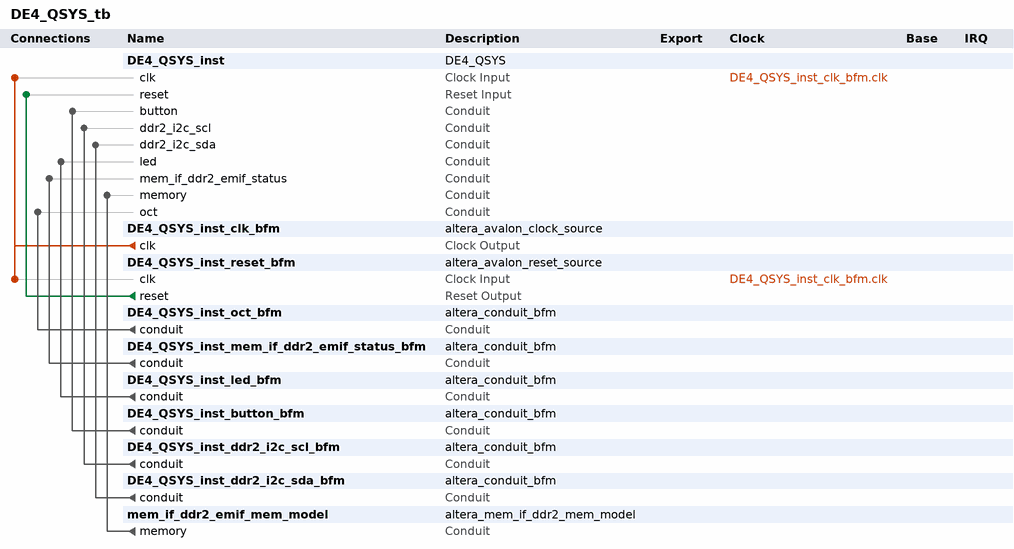
[diagram p0: system contents]
# Platform Designer (Qsys) system DE4_QSYS_tb, Stratix IV EP4SGX530KH40C2
# Parameters at their usual value, and those the tool derives, are not listed.
package require -exact qsys 13.0
create_system DE4_QSYS_tb
set_project_property DEVICE_FAMILY {Stratix IV}
set_project_property DEVICE EP4SGX530KH40C2

add_instance DE4_QSYS_inst DE4_QSYS 1.0

add_instance DE4_QSYS_inst_clk_bfm altera_avalon_clock_source 13.0

add_instance DE4_QSYS_inst_reset_bfm altera_avalon_reset_source 13.0
set_instance_parameter_value DE4_QSYS_inst_reset_bfm ASSERT_HIGH_RESET 0
set_instance_parameter_value DE4_QSYS_inst_reset_bfm INITIAL_RESET_CYCLES 50

add_instance DE4_QSYS_inst_oct_bfm altera_conduit_bfm 13.0
set_instance_parameter_value DE4_QSYS_inst_oct_bfm CLOCKED_SIGNAL false
set_instance_parameter_value DE4_QSYS_inst_oct_bfm ENABLE_RESET false
set_instance_parameter_value DE4_QSYS_inst_oct_bfm SIGNAL_ROLES rdn,rup
set_instance_parameter_value DE4_QSYS_inst_oct_bfm SIGNAL_WIDTHS 1,1
set_instance_parameter_value DE4_QSYS_inst_oct_bfm SIGNAL_DIRECTIONS output,output

add_instance DE4_QSYS_inst_mem_if_ddr2_emif_status_bfm altera_conduit_bfm 13.0
set_instance_parameter_value DE4_QSYS_inst_mem_if_ddr2_emif_status_bfm CLOCKED_SIGNAL false
set_instance_parameter_value DE4_QSYS_inst_mem_if_ddr2_emif_status_bfm ENABLE_RESET false
set_instance_parameter_value DE4_QSYS_inst_mem_if_ddr2_emif_status_bfm SIGNAL_ROLES local_init_done,local_cal_success,local_cal_fail
set_instance_parameter_value DE4_QSYS_inst_mem_if_ddr2_emif_status_bfm SIGNAL_WIDTHS 1,1,1
set_instance_parameter_value DE4_QSYS_inst_mem_if_ddr2_emif_status_bfm SIGNAL_DIRECTIONS input,input,input

add_instance DE4_QSYS_inst_led_bfm altera_conduit_bfm 13.0
set_instance_parameter_value DE4_QSYS_inst_led_bfm CLOCKED_SIGNAL false
set_instance_parameter_value DE4_QSYS_inst_led_bfm ENABLE_RESET false
set_instance_parameter_value DE4_QSYS_inst_led_bfm SIGNAL_WIDTHS 8
set_instance_parameter_value DE4_QSYS_inst_led_bfm SIGNAL_DIRECTIONS input

add_instance DE4_QSYS_inst_button_bfm altera_conduit_bfm 13.0
set_instance_parameter_value DE4_QSYS_inst_button_bfm CLOCKED_SIGNAL false
set_instance_parameter_value DE4_QSYS_inst_button_bfm ENABLE_RESET false
set_instance_parameter_value DE4_QSYS_inst_button_bfm SIGNAL_WIDTHS 4
set_instance_parameter_value DE4_QSYS_inst_button_bfm SIGNAL_DIRECTIONS output

add_instance DE4_QSYS_inst_ddr2_i2c_scl_bfm altera_conduit_bfm 13.0
set_instance_parameter_value DE4_QSYS_inst_ddr2_i2c_scl_bfm CLOCKED_SIGNAL false
set_instance_parameter_value DE4_QSYS_inst_ddr2_i2c_scl_bfm ENABLE_RESET false
set_instance_parameter_value DE4_QSYS_inst_ddr2_i2c_scl_bfm SIGNAL_WIDTHS 1
set_instance_parameter_value DE4_QSYS_inst_ddr2_i2c_scl_bfm SIGNAL_DIRECTIONS input

add_instance DE4_QSYS_inst_ddr2_i2c_sda_bfm altera_conduit_bfm 13.0
set_instance_parameter_value DE4_QSYS_inst_ddr2_i2c_sda_bfm CLOCKED_SIGNAL false
set_instance_parameter_value DE4_QSYS_inst_ddr2_i2c_sda_bfm ENABLE_RESET false
set_instance_parameter_value DE4_QSYS_inst_ddr2_i2c_sda_bfm SIGNAL_WIDTHS 1
set_instance_parameter_value DE4_QSYS_inst_ddr2_i2c_sda_bfm SIGNAL_DIRECTIONS bidir

add_instance mem_if_ddr2_emif_mem_model altera_mem_if_ddr2_mem_model 13.0
set_instance_parameter_value mem_if_ddr2_emif_mem_model MEM_VENDOR Micron
set_instance_parameter_value mem_if_ddr2_emif_mem_model MEM_FORMAT UNBUFFERED
set_instance_parameter_value mem_if_ddr2_emif_mem_model DISCRETE_FLY_BY true
set_instance_parameter_value mem_if_ddr2_emif_mem_model DEVICE_DEPTH 1
set_instance_parameter_value mem_if_ddr2_emif_mem_model MEM_MIRROR_ADDRESSING 0
set_instance_parameter_value mem_if_ddr2_emif_mem_model MEM_CLK_FREQ_MAX 400.0
set_instance_parameter_value mem_if_ddr2_emif_mem_model MEM_ROW_ADDR_WIDTH 14
set_instance_parameter_value mem_if_ddr2_emif_mem_model MEM_COL_ADDR_WIDTH 10
set_instance_parameter_value mem_if_ddr2_emif_mem_model MEM_DQ_WIDTH 64
set_instance_parameter_value mem_if_ddr2_emif_mem_model MEM_DQ_PER_DQS 8
set_instance_parameter_value mem_if_ddr2_emif_mem_model MEM_BANKADDR_WIDTH 3
set_instance_parameter_value mem_if_ddr2_emif_mem_model MEM_IF_DM_PINS_EN true
set_instance_parameter_value mem_if_ddr2_emif_mem_model MEM_IF_DQSN_EN true
set_instance_parameter_value mem_if_ddr2_emif_mem_model MEM_NUMBER_OF_DIMMS 1
set_instance_parameter_value mem_if_ddr2_emif_mem_model MEM_NUMBER_OF_RANKS_PER_DIMM 1
set_instance_parameter_value mem_if_ddr2_emif_mem_model MEM_NUMBER_OF_RANKS_PER_DEVICE 1
set_instance_parameter_value mem_if_ddr2_emif_mem_model MEM_RANK_MULTIPLICATION_FACTOR 1
set_instance_parameter_value mem_if_ddr2_emif_mem_model MEM_CK_WIDTH 2
set_instance_parameter_value mem_if_ddr2_emif_mem_model MEM_CS_WIDTH 1
set_instance_parameter_value mem_if_ddr2_emif_mem_model MEM_CLK_EN_WIDTH 1
set_instance_parameter_value mem_if_ddr2_emif_mem_model ALTMEMPHY_COMPATIBLE_MODE false
set_instance_parameter_value mem_if_ddr2_emif_mem_model NEXTGEN true
set_instance_parameter_value mem_if_ddr2_emif_mem_model MEM_IF_BOARD_BASE_DELAY 10
set_instance_parameter_value mem_if_ddr2_emif_mem_model MEM_IF_SIM_VALID_WINDOW 0
set_instance_parameter_value mem_if_ddr2_emif_mem_model MEM_GUARANTEED_WRITE_INIT false
set_instance_parameter_value mem_if_ddr2_emif_mem_model MEM_VERBOSE true
set_instance_parameter_value mem_if_ddr2_emif_mem_model PINGPONGPHY_EN false
set_instance_parameter_value mem_if_ddr2_emif_mem_model REFRESH_BURST_VALIDATION false
set_instance_parameter_value mem_if_ddr2_emif_mem_model MEM_BL 8
set_instance_parameter_value mem_if_ddr2_emif_mem_model MEM_BT Sequential
set_instance_parameter_value mem_if_ddr2_emif_mem_model MEM_ASR Manual
set_instance_parameter_value mem_if_ddr2_emif_mem_model MEM_SRT {2x refresh rate}
set_instance_parameter_value mem_if_ddr2_emif_mem_model MEM_PD {Fast exit}
set_instance_parameter_value mem_if_ddr2_emif_mem_model MEM_DRV_STR Full
set_instance_parameter_value mem_if_ddr2_emif_mem_model MEM_DLL_EN true
set_instance_parameter_value mem_if_ddr2_emif_mem_model MEM_RTT_NOM 50
set_instance_parameter_value mem_if_ddr2_emif_mem_model MEM_ATCL 0
set_instance_parameter_value mem_if_ddr2_emif_mem_model MEM_TCL 6
set_instance_parameter_value mem_if_ddr2_emif_mem_model MEM_AUTO_LEVELING_MODE true
set_instance_parameter_value mem_if_ddr2_emif_mem_model MEM_USER_LEVELING_MODE Leveling
set_instance_parameter_value mem_if_ddr2_emif_mem_model MEM_INIT_EN false
set_instance_parameter_value mem_if_ddr2_emif_mem_model DAT_DATA_WIDTH 32
set_instance_parameter_value mem_if_ddr2_emif_mem_model TIMING_TIS 375
set_instance_parameter_value mem_if_ddr2_emif_mem_model TIMING_TIH 375
set_instance_parameter_value mem_if_ddr2_emif_mem_model TIMING_TDS 250
set_instance_parameter_value mem_if_ddr2_emif_mem_model TIMING_TDH 250
set_instance_parameter_value mem_if_ddr2_emif_mem_model TIMING_TDQSQ 200
set_instance_parameter_value mem_if_ddr2_emif_mem_model TIMING_TQHS 300
set_instance_parameter_value mem_if_ddr2_emif_mem_model TIMING_TDQSCK 350
set_instance_parameter_value mem_if_ddr2_emif_mem_model TIMING_TDQSCKDS 450
set_instance_parameter_value mem_if_ddr2_emif_mem_model TIMING_TDQSCKDM 900
set_instance_parameter_value mem_if_ddr2_emif_mem_model TIMING_TDQSCKDL 1200
set_instance_parameter_value mem_if_ddr2_emif_mem_model TIMING_TDQSS 0.25
set_instance_parameter_value mem_if_ddr2_emif_mem_model TIMING_TDQSH 0.35
set_instance_parameter_value mem_if_ddr2_emif_mem_model TIMING_TDSH 0.2
set_instance_parameter_value mem_if_ddr2_emif_mem_model TIMING_TDSS 0.2
set_instance_parameter_value mem_if_ddr2_emif_mem_model MEM_TINIT_US 200
set_instance_parameter_value mem_if_ddr2_emif_mem_model MEM_TMRD_CK 5
set_instance_parameter_value mem_if_ddr2_emif_mem_model MEM_TRAS_NS 40.0
set_instance_parameter_value mem_if_ddr2_emif_mem_model MEM_TRCD_NS 15.0
set_instance_parameter_value mem_if_ddr2_emif_mem_model MEM_TRP_NS 15.0
set_instance_parameter_value mem_if_ddr2_emif_mem_model MEM_TREFI_US 7.8
set_instance_parameter_value mem_if_ddr2_emif_mem_model MEM_TRFC_NS 127.5
set_instance_parameter_value mem_if_ddr2_emif_mem_model CFG_TCCD_NS 2.5
set_instance_parameter_value mem_if_ddr2_emif_mem_model MEM_TWR_NS 15.0
set_instance_parameter_value mem_if_ddr2_emif_mem_model MEM_TWTR 3
set_instance_parameter_value mem_if_ddr2_emif_mem_model MEM_TFAW_NS 37.5
set_instance_parameter_value mem_if_ddr2_emif_mem_model MEM_TRRD_NS 7.5
set_instance_parameter_value mem_if_ddr2_emif_mem_model MEM_TRTP_NS 7.5
set_instance_parameter_value mem_if_ddr2_emif_mem_model RATE Half
set_instance_parameter_value mem_if_ddr2_emif_mem_model MEM_CLK_FREQ 300.0
set_instance_parameter_value mem_if_ddr2_emif_mem_model USE_MEM_CLK_FREQ false
set_instance_parameter_value mem_if_ddr2_emif_mem_model FORCE_DQS_TRACKING AUTO
set_instance_parameter_value mem_if_ddr2_emif_mem_model FORCE_SHADOW_REGS AUTO
set_instance_parameter_value mem_if_ddr2_emif_mem_model MRS_MIRROR_PING_PONG_ATSO false
set_instance_parameter_value mem_if_ddr2_emif_mem_model PARSE_FRIENDLY_DEVICE_FAMILY_PARAM_VALID false
set_instance_parameter_value mem_if_ddr2_emif_mem_model SPEED_GRADE 2
set_instance_parameter_value mem_if_ddr2_emif_mem_model IS_ES_DEVICE false
set_instance_parameter_value mem_if_ddr2_emif_mem_model DISABLE_CHILD_MESSAGING false
set_instance_parameter_value mem_if_ddr2_emif_mem_model HARD_EMIF false
set_instance_parameter_value mem_if_ddr2_emif_mem_model HHP_HPS false
set_instance_parameter_value mem_if_ddr2_emif_mem_model HHP_HPS_VERIFICATION false
set_instance_parameter_value mem_if_ddr2_emif_mem_model HHP_HPS_SIMULATION false
set_instance_parameter_value mem_if_ddr2_emif_mem_model HPS_PROTOCOL DEFAULT
set_instance_parameter_value mem_if_ddr2_emif_mem_model CUT_NEW_FAMILY_TIMING true

# connections
add_connection DE4_QSYS_inst_clk_bfm.clk DE4_QSYS_inst.clk clock
add_connection DE4_QSYS_inst_clk_bfm.clk DE4_QSYS_inst_reset_bfm.clk clock
add_connection DE4_QSYS_inst_reset_bfm.reset DE4_QSYS_inst.reset reset
add_connection DE4_QSYS_inst_button_bfm.conduit DE4_QSYS_inst.button conduit
add_connection DE4_QSYS_inst_ddr2_i2c_scl_bfm.conduit DE4_QSYS_inst.ddr2_i2c_scl conduit
add_connection DE4_QSYS_inst_ddr2_i2c_sda_bfm.conduit DE4_QSYS_inst.ddr2_i2c_sda conduit
add_connection DE4_QSYS_inst_led_bfm.conduit DE4_QSYS_inst.led conduit
add_connection DE4_QSYS_inst_mem_if_ddr2_emif_status_bfm.conduit DE4_QSYS_inst.mem_if_ddr2_emif_status conduit
add_connection DE4_QSYS_inst_oct_bfm.conduit DE4_QSYS_inst.oct conduit
add_connection mem_if_ddr2_emif_mem_model.memory DE4_QSYS_inst.memory conduit

set_interconnect_requirement {$system} qsys_mm.clockCrossingAdapter HANDSHAKE
set_interconnect_requirement {$system} qsys_mm.maxAdditionalLatency 1

save_system DE4_QSYS_tb.qsys
